# Altium schematic sheet Drivers.SchDoc: 7-Segment Digit
size A4; Address1: Smoka Wawelskiego 1; Address2: 30-535 Kraków, Poland; DocumentNumber: 6; Revision: v01; SheetNumber: 6; SheetTotal: 9; Author: Miroslaw Folejewski; CompanyName: Mirko Electronics; DrawnBy: Miroslaw Folejewski; Engineer: Miroslaw Folejewski; PageSetup: Record=PageOptions|CenterHorizontal=True|CenterVertical=True|PrintScale=1.00|XCorrection=1.00|YCorrection=1.00|PrintKind=0|BorderSize=5000000|LeftOffset=0|BottomOffset=0|Orientation=2|PaperLength=1000|PaperWidth=1000|Scale=100|PaperSource=7|PrintQuality=-4|MediaType=1|DitherType=10|PaperKind=A4|PrintScaleMode=1; PageSize: A4; Designators: -; ProjectName: 7-Segment LED Matrix Display
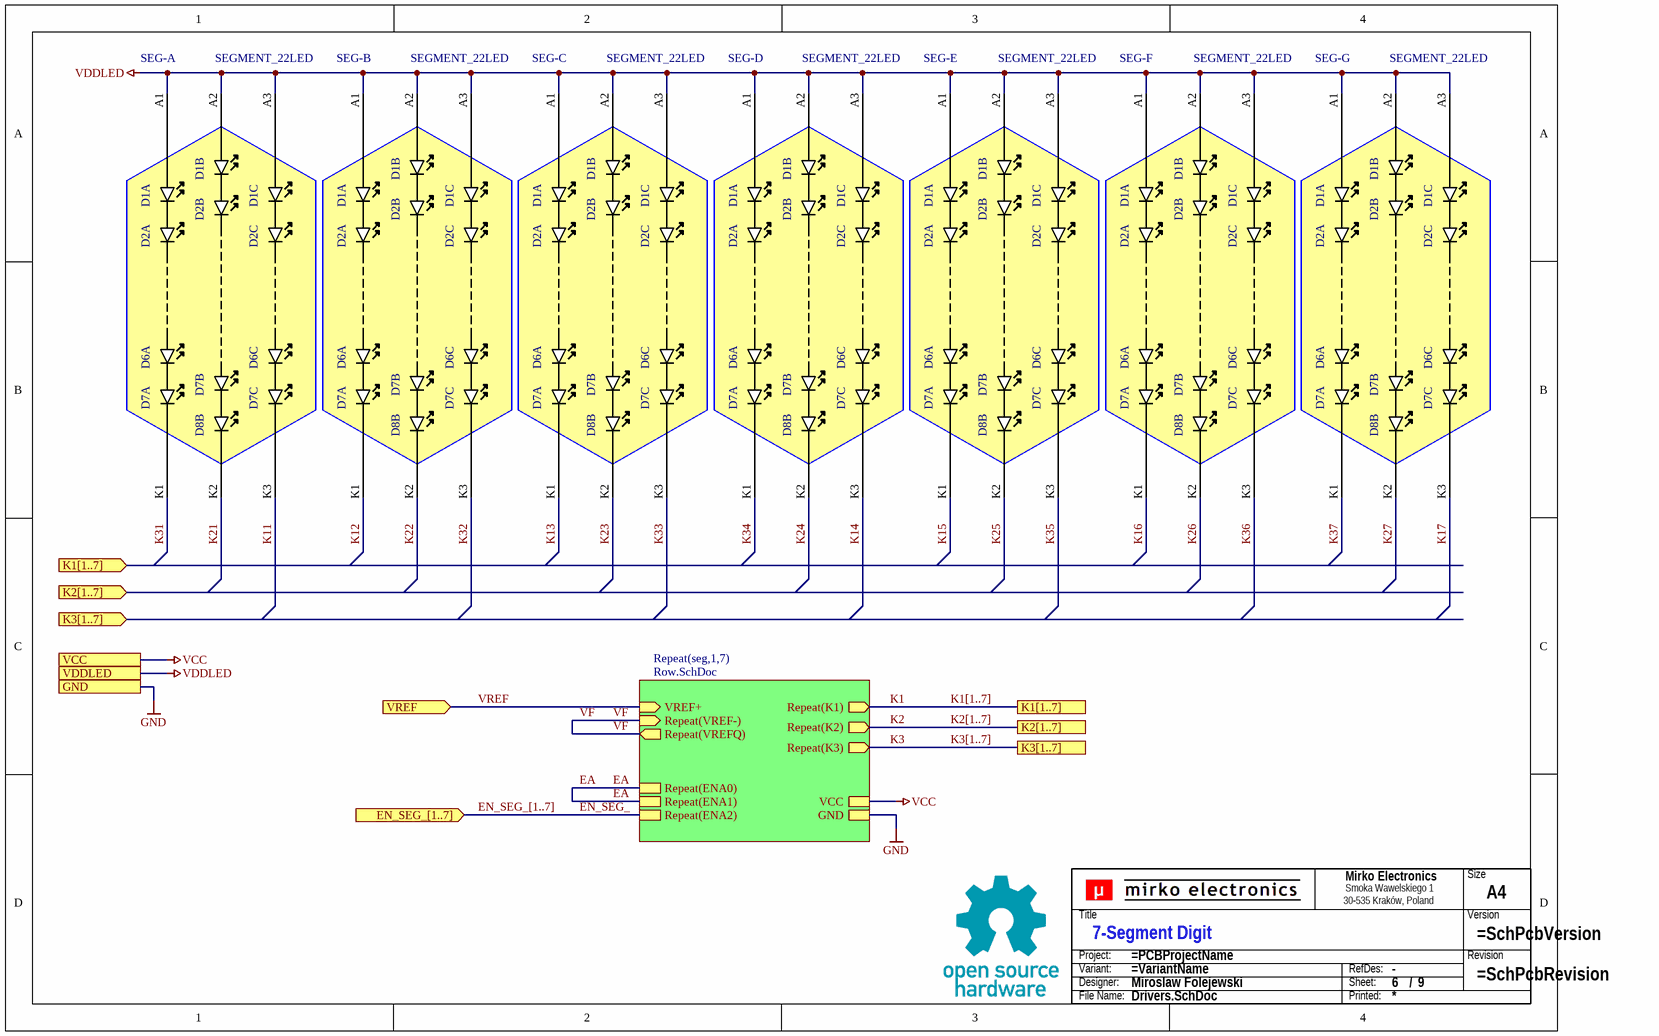
[diagram p0: Drivers.SchDoc]

## Parts
?  (no value)  (graphical)
SEG-A  SEGMENT_22LED  [SEGMENT_22LED_H]
SEG-B  SEGMENT_22LED  [SEGMENT_22LED_V]
SEG-C  SEGMENT_22LED  [SEGMENT_22LED_V]
SEG-D  SEGMENT_22LED  [SEGMENT_22LED_H]
SEG-E  SEGMENT_22LED  [SEGMENT_22LED_V]
SEG-F  SEGMENT_22LED  [SEGMENT_22LED_V]
SEG-G  SEGMENT_22LED  [SEGMENT_22LED_H]
TB?  Title block  (value not drawn)  (graphical)

## Sub-sheets
Repeat(seg,1,7) = Row.SchDoc: Repeat(ENA0), VREF+ (in), VCC, GND, Repeat(K1) (out), Repeat(K2) (out), Repeat(K3) (out), Repeat(ENA1), Repeat(ENA2), Repeat(VREF-) (in), Repeat(VREFQ) (out)

## Ports
EN_SEG_[1..7] (in), GND, K1[1..7], K1[1..7] (in), K2[1..7], K2[1..7] (in), K3[1..7], K3[1..7] (in), VCC, VDDLED, VREF (in)

## Nets
GND: port GND, sheet Repeat(seg,1,7)/GND
VCC: port VCC, sheet Repeat(seg,1,7)/VCC
VDDLED: SEG-A.A1(VDD) SEG-A.A2(VDD) SEG-A.A3(VDD) SEG-B.A1(VDD) SEG-B.A2(VDD) SEG-B.A3(VDD) SEG-C.A1(VDD) SEG-C.A2(VDD) SEG-C.A3(VDD) SEG-D.A1(VDD) SEG-D.A2(VDD) SEG-D.A3(VDD) SEG-E.A1(VDD) SEG-E.A2(VDD) SEG-E.A3(VDD) SEG-F.A1(VDD) SEG-F.A2(VDD) SEG-F.A3(VDD) SEG-G.A1(VDD) SEG-G.A2(VDD) SEG-G.A3(VDD) ; port VDDLED
EA: sheet Repeat(seg,1,7)/Repeat(ENA0), sheet Repeat(seg,1,7)/Repeat(ENA1)
EN_SEG_: sheet Repeat(seg,1,7)/Repeat(ENA2)
K1: sheet Repeat(seg,1,7)/Repeat(K1)
K2: sheet Repeat(seg,1,7)/Repeat(K2)
K3: sheet Repeat(seg,1,7)/Repeat(K3)
K11: SEG-A.K3(LED_R)
K12: SEG-B.K1(LED_R)
K13: SEG-C.K1(LED_R)
K14: SEG-D.K3(LED_R)
K15: SEG-E.K1(LED_R)
K16: SEG-F.K1(LED_R)
K17: SEG-G.K3(LED_R)
K21: SEG-A.K2(LED_R)
K22: SEG-B.K2(LED_R)
K23: SEG-C.K2(LED_R)
K24: SEG-D.K2(LED_R)
K25: SEG-E.K2(LED_R)
K26: SEG-F.K2(LED_R)
K27: SEG-G.K2(LED_R)
K31: SEG-A.K1(LED_R)
K32: SEG-B.K3(LED_R)
K33: SEG-C.K3(LED_R)
K34: SEG-D.K1(LED_R)
K35: SEG-E.K3(LED_R)
K36: SEG-F.K3(LED_R)
K37: SEG-G.K1(LED_R)
VF: sheet Repeat(seg,1,7)/Repeat(VREF-), sheet Repeat(seg,1,7)/Repeat(VREFQ)
VREF: port VREF, sheet Repeat(seg,1,7)/VREF+

## Buses and harness runs
bus EA
bus EN_SEG_[1..7] = port EN_SEG_[1..7]
bus K1[1..7] = port K1[1..7]
bus K2[1..7] = port K2[1..7]
bus K3[1..7] = port K3[1..7]
bus VF

## Notes on the sheet
- Title
- Size
- Revision
- Checked By:
- Project:
- Variant:
- Engineer:
- Date:
- Sheet:
- /
- Designators
- Approved By:
- File:
- (in symbol SCH_TITLE_BLOCK_V1) Size; Title; Version; Project:; Revision; Variant:; RefDes:; Designer:; Sheet:; /; File Name:; Printed:
- (in symbol SEGMENT_22LED) D1B; D1A; D1C; D2B; D2A; D2C; D6A; D6C; D7B; D7A; D7C; D8B

## Library data of the parts
? = Title Block NeoStrain
TB? = SCH_TITLE_BLOCK_V1: Component Type: Title block; Manufacturer: -; Mounting Type: Non component; MPN: -; Operating Temperature: -; Package: -; Specification: Title block; Value: Title block; Replacement: -; System: ?